# Altium schematic sheet Copy of STM32_microcontroller_IOs.SchDoc: STM32_microcontroller_IOs
size A4; Date: Not used; ApprovedBy: Not used; CheckedBy: Not used; Author: Not used; CompanyName: STMicroelectronics; DrawnBy: Not used; Engineer: Not used; Organization: Not used; Address1: Not used; Address2: Not used; Address3: Not used; Address4: Not used; DocumentNumber: 3; Revision: Not used; SheetNumber: 3; SheetTotal: 9; CurrentTime: Not used; CurrentDate: Not used; Time: Not used; DocumentFullPathAndName: Not used; DocumentName: Not used; ModifiedDate: Not used; ImagePath: Not used; ProjectName: Not used; Application_BuildNumber: Not used
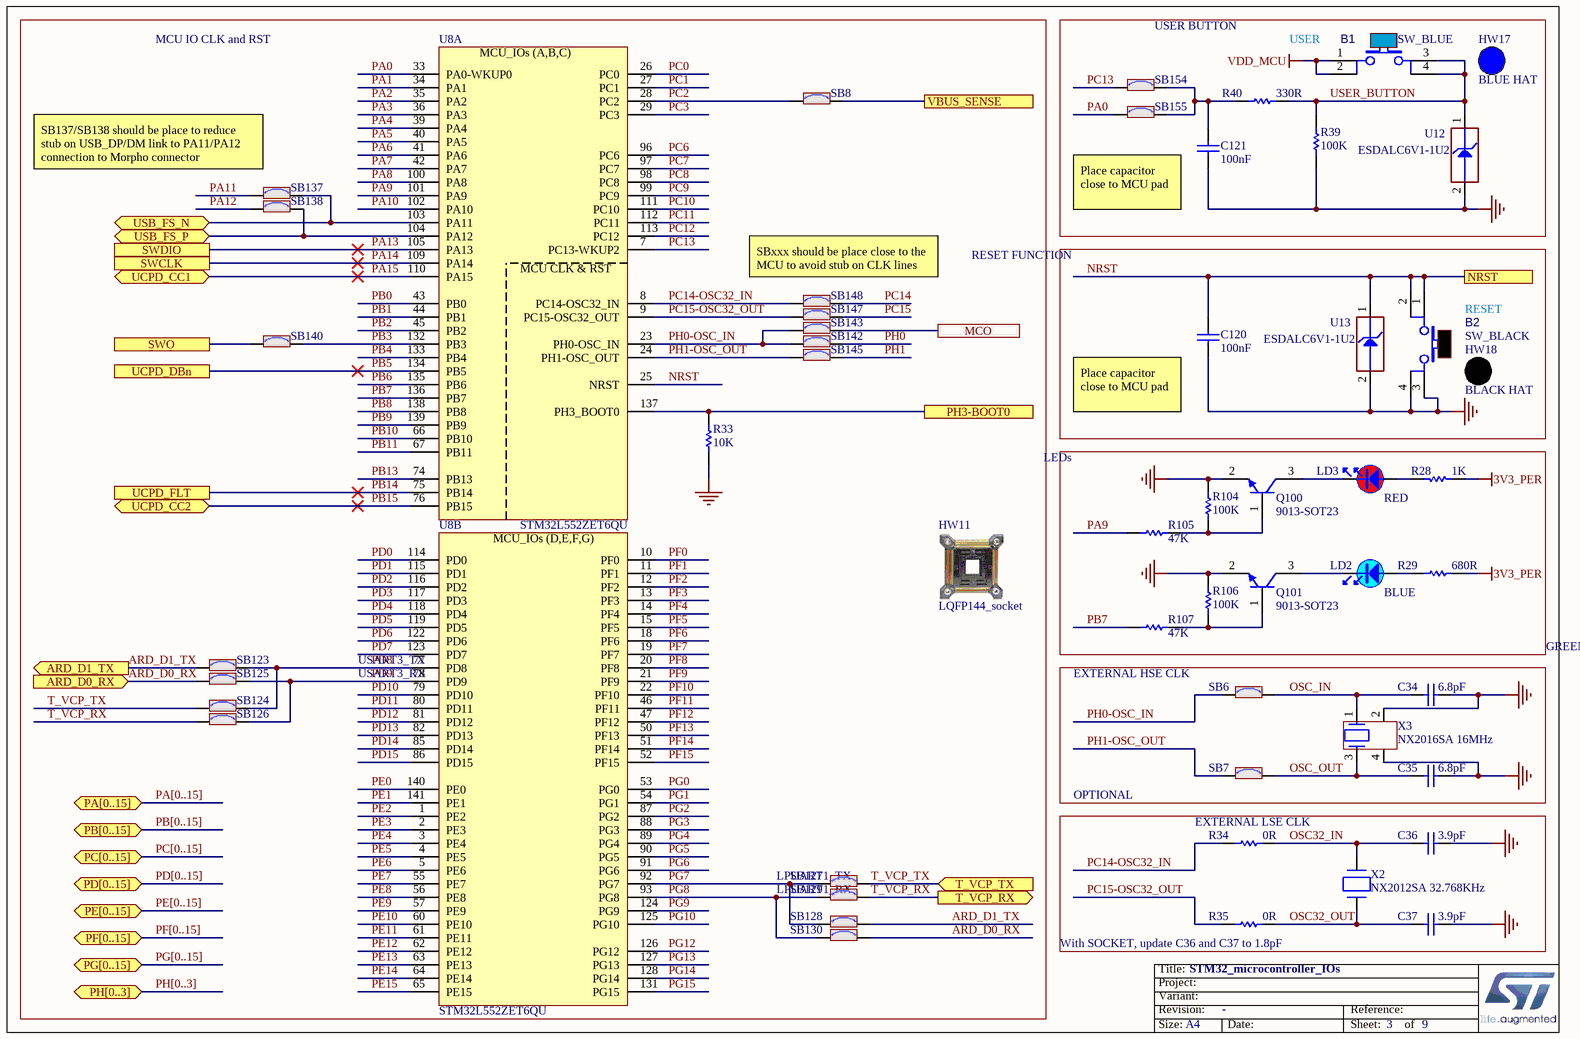
[diagram p0: Copy of STM32_microcontroller_IOs.SchDoc]

## Parts
B1  value SW_BLUE  [SWI_WEALTHMETAL_TD-0341_4P_BLUE]
B2  value SW_BLACK  [SWI_WEALTHMETAL_TD-0341_4P_BLACK]
C34  value 6.8pF  [C0402]  (hidden comment: Capacitor)
C35  value 6.8pF  [C0402]  (hidden comment: Capacitor)
C36  value 3.9pF  [C0402]  (hidden comment: Capacitor)
C37  value 3.9pF  [C0402]  (hidden comment: Capacitor)
C120  value 100nF  [C0603]
C121  value 100nF  [C0603]
HW11  value LQFP144_socket  (mechanical)
HW17  value BLUE HAT  (mechanical)
HW18  value BLACK HAT  (mechanical)
LD2  value BLUE  [LED_0603_VISHAY_VLMB1300-GS08_BLUE_1A2K_H0P8]
LD3  value RED  [LED_0603_RED_H0P4]
Q100  value 9013-SOT23  [NPN_SOT23]
Q101  value 9013-SOT23  [NPN_SOT23]
R28  value 1K  [R0603]
R29  value 680R  [R0603]
R33  value 10K  [R0603]
R34  value 0R  [R0603]
R35  value 0R  [R0603]
R39  value 100K  [R0603]
R40  value 330R  [R0603]
R104  value 100K  [R0603]
R105  value 47K  [R0603]
R106  value 100K  [R0603]
R107  value 47K  [R0603]
SB6  (no value)  [SOLDER-BRIDGE_R0603-0R]
SB7  (no value)  [SOLDER-BRIDGE_R0603-0R]
SB8  (no value)  [SOLDER-BRIDGE_R0603-0R]
SB123  (no value)  [SOLDER-BRIDGE_R0603-0R]
SB124  (no value)  [SOLDER-BRIDGE_R0603-0R]
SB125  (no value)  [SOLDER-BRIDGE_R0603-0R]
SB126  (no value)  [SOLDER-BRIDGE_R0603-0R]
SB127  (no value)  [SOLDER-BRIDGE_R0603-0R]
SB128  (no value)  [SOLDER-BRIDGE_R0603-0R]
SB129  (no value)  [SOLDER-BRIDGE_R0603-0R]
SB130  (no value)  [SOLDER-BRIDGE_R0603-0R]
SB137  (no value)  [SOLDER-BRIDGE_R0603-0R]
SB138  (no value)  [SOLDER-BRIDGE_R0603-0R]
SB140  (no value)  [SOLDER-BRIDGE_R0603-0R]
SB142  (no value)  [SOLDER-BRIDGE_R0603-0R]
SB143  (no value)  [SOLDER-BRIDGE_R0603-0R]
SB145  (no value)  [SOLDER-BRIDGE_R0603-0R]
SB147  (no value)  [SOLDER-BRIDGE_R0603-0R]
SB148  (no value)  [SOLDER-BRIDGE_R0603-0R]
SB154  (no value)  [SOLDER-BRIDGE_R0603-0R]
SB155  (no value)  [SOLDER-BRIDGE_R0603-0R]
U8  STM32L552ZET6QU  [ICC_LQFP144_20X20_P050]  (parts A,B of 3)
U12  value ESDALC6V1-1U2  [ESD_ST0201]
U13  value ESDALC6V1-1U2  [ESD_ST0201]
X2  value NX2012SA 32.768KHz  [CRY_NX2012SA_2P]  (hidden comment: XTAL_2_PINS)
X3  value NX2016SA 16MHz  [CRY_NX2016SA_4P]  (hidden comment: XTAL_4_PINS)

## Blocks framed on the sheet
LEDs: LD2 LD3 Q100 Q101 R28 R29 R104-R107

## Ports
ARD_D0_RX (in), ARD_D1_TX (out), MCO, NRST, PA[0..15] (bidir), PB[0..15] (bidir), PC[0..15] (bidir), PD[0..15] (bidir), PE[0..15] (bidir), PF[0..15] (bidir), PG[0..15] (bidir), PH3-BOOT0, PH[0..3] (bidir), SWCLK, SWDIO, SWO, T_VCP_RX (out), T_VCP_TX (in), UCPD_CC1 (bidir), UCPD_CC2 (bidir), UCPD_DBn, UCPD_FLT, USB_FS_N (bidir), USB_FS_P (bidir), VBUS_SENSE

## Nets
3V3_PER: R28.1 R29.1
GND: B2.3 B2.4 C34.2 C35.2 C36.2 C37.2 C120.1 C121.1 Q100.2(E) Q101.2(E) R33.2 R39.1 R104.1 R106.1 U12.2(GND) U13.2(GND) X3.2 X3.4
VDD_MCU: B1.1 B1.2
ARD_D0_RX: SB125.2 SB130.1 ; port ARD_D0_RX
ARD_D1_TX: SB123.2 SB128.1 ; port ARD_D1_TX
MCO: SB143.2 ; port MCO
NRST: B2.1 B2.2 C120.2 U8.25(NRST) U13.1(IO1) ; port NRST
OSC32_IN: C36.1 R34.2 X2.2(X2)
OSC32_OUT: C37.1 R35.2 X2.1(X1)
OSC_IN: C34.1 SB6.2 X3.1
OSC_OUT: C35.1 SB7.2 X3.3
PA0: SB155.2 U8.33(PA0-WKUP0)
PA1: U8.34(PA1)
PA2: U8.35(PA2)
PA3: U8.36(PA3)
PA4: U8.39(PA4)
PA5: U8.40(PA5)
PA6: U8.41(PA6)
PA7: U8.42(PA7)
PA8: U8.100(PA8)
PA9: R105.1 U8.101(PA9)
PA10: U8.102(PA10)
PA11: SB137.1
PA12: SB138.1
PA13: U8.105(PA13) ; port SWDIO
PA14: U8.109(PA14) ; port SWCLK
PA15: U8.110(PA15) ; port UCPD_CC1
PB0: U8.43(PB0)
PB1: U8.44(PB1)
PB2: U8.45(PB2)
PB3: SB140.2 U8.132(PB3)
PB4: U8.133(PB4)
PB5: U8.134(PB5) ; port UCPD_DBn
PB6: U8.135(PB6)
PB7: R107.1 U8.136(PB7)
PB8: U8.138(PB8)
PB9: U8.139(PB9)
PB10: U8.66(PB10)
PB11: U8.67(PB11)
PB13: U8.74(PB13)
PB14: U8.75(PB14) ; port UCPD_FLT
PB15: U8.76(PB15) ; port UCPD_CC2
PC0: U8.26(PC0)
PC1: U8.27(PC1)
PC2: SB8.1 U8.28(PC2)
PC3: U8.29(PC3)
PC6: U8.96(PC6)
PC7: U8.97(PC7)
PC8: U8.98(PC8)
PC9: U8.99(PC9)
PC10: U8.111(PC10)
PC11: U8.112(PC11)
PC12: U8.113(PC12)
PC13: SB154.2 U8.7(PC13-WKUP2)
PC14: SB148.2
PC14-OSC32_IN: R34.1 SB148.1 U8.8(PC14-OSC32_IN)
PC15: SB147.2
PC15-OSC32_OUT: R35.1 SB147.1 U8.9(PC15-OSC32_OUT)
PD0: U8.114(PD0)
PD1: U8.115(PD1)
PD2: U8.116(PD2)
PD3: U8.117(PD3)
PD4: U8.118(PD4)
PD5: U8.119(PD5)
PD6: U8.122(PD6)
PD7: U8.123(PD7)
PD8: SB123.1 SB124.1 U8.77(PD8)
PD9: SB125.1 SB126.1 U8.78(PD9)
PD10: U8.79(PD10)
PD11: U8.80(PD11)
PD12: U8.81(PD12)
PD13: U8.82(PD13)
PD14: U8.85(PD14)
PD15: U8.86(PD15)
PE0: U8.140(PE0)
PE1: U8.141(PE1)
PE2: U8.1(PE2)
PE3: U8.2(PE3)
PE4: U8.3(PE4)
PE5: U8.4(PE5)
PE6: U8.5(PE6)
PE7: U8.55(PE7)
PE8: U8.56(PE8)
PE9: U8.57(PE9)
PE10: U8.60(PE10)
PE11: U8.61(PE11)
PE12: U8.62(PE12)
PE13: U8.63(PE13)
PE14: U8.64(PE14)
PE15: U8.65(PE15)
PF0: U8.10(PF0)
PF1: U8.11(PF1)
PF2: U8.12(PF2)
PF3: U8.13(PF3)
PF4: U8.14(PF4)
PF5: U8.15(PF5)
PF6: U8.18(PF6)
PF7: U8.19(PF7)
PF8: U8.20(PF8)
PF9: U8.21(PF9)
PF10: U8.22(PF10)
PF11: U8.46(PF11)
PF12: U8.47(PF12)
PF13: U8.50(PF13)
PF14: U8.51(PF14)
PF15: U8.52(PF15)
PG0: U8.53(PG0)
PG1: U8.54(PG1)
PG2: U8.87(PG2)
PG3: U8.88(PG3)
PG4: U8.89(PG4)
PG5: U8.90(PG5)
PG6: U8.91(PG6)
PG7: SB127.2 SB128.2 U8.92(PG7)
PG8: SB129.2 SB130.2 U8.93(PG8)
PG9: U8.124(PG9)
PG10: U8.125(PG10)
PG12: U8.126(PG12)
PG13: U8.127(PG13)
PG14: U8.128(PG14)
PG15: U8.131(PG15)
PH0: SB142.2
PH0-OSC_IN: SB6.1 SB142.1 SB143.1 U8.23(PH0-OSC_IN)
PH1: SB145.2
PH1-OSC_OUT: SB7.1 SB145.1 U8.24(PH1-OSC_OUT)
PH3-BOOT0: R33.1 U8.137(PH3_BOOT0) ; port PH3-BOOT0
SWO: SB140.1 ; port SWO
T_VCP_RX: SB126.2 SB129.1 ; port T_VCP_RX
T_VCP_TX: SB124.2 SB127.1 ; port T_VCP_TX
USB_FS_N: SB137.2 U8.103(PA11) ; port USB_FS_N
USB_FS_P: SB138.2 U8.104(PA12) ; port USB_FS_P
USER_BUTTON: B1.3 B1.4 R39.2 R40.2 U12.1(IO1)
VBUS_SENSE: SB8.2 ; port VBUS_SENSE
NetC121_2: C121.2 R40.1 SB154.1 SB155.1
NetLD2_1: LD2.1 R29.2
NetLD2_2: LD2.2 Q101.3(C)
NetLD3_1: LD3.1 R28.2
NetLD3_2: LD3.2 Q100.3(C)
NetQ100_1: Q100.1(B) R104.2 R105.2
NetQ101_1: Q101.1(B) R106.2 R107.2

## Buses and harness runs
bus PA[0..15] = port PA[0..15]
bus PB[0..15] = port PB[0..15]
bus PC[0..15] = port PC[0..15]
bus PD[0..15] = port PD[0..15]
bus PE[0..15] = port PE[0..15]
bus PF[0..15] = port PF[0..15]
bus PG[0..15] = port PG[0..15]
bus PH[0..3] = port PH[0..3]

## Notes on the sheet
- MCU IO CLK and RST
- USER BUTTON
- USER
- SB137/SB138 should be place to reduce stub on USB_DP/DM link to PA11/PA12 connection to Morpho connector
- Place capacitor close to MCU pad
- SBxxx should be place close to the MCU to avoid stub on CLK lines
- RESET FUNCTION
- RESET
- (near C120) Place capacitor close to MCU pad
- (near C34) GREEN LED IS ON ARDUINO SHEET
- USART3_TX
- USART3_RX
- (near R107) EXTERNAL HSE CLK
- OPTIONAL
- EXTERNAL LSE CLK
- LPUART1_TX
- LPUART1_RX
- (near R35) With SOCKET, update C36 and C37 to 1.8pF
- Title:
- Project:
- Size:
- Revision:
- Variant:
- A4
- -
- Date:
- Reference:
- Sheet:
- of
- (in symbol MCD-01055, part A) MCU_IOs (A,B,C); MCU CLK & RST
- (in symbol MCD-01055, part B) MCU_IOs (D,E,F,G)

## Library data of the parts
B1 = MCD-00002: Non-Open Push-Button 0.1A 24V BLUE; Manufacturer_Part_Number: TD0341X-G01-BLU; Manufacturer: WEALTHMETAL; Part_Type: Misc; Provided_By: Subcon; Initial_Board_Reference: MB1274; Internal_Part_Number: MCD-00002; ECCN_US: n/a; ECCN_EU: n/a; ComponentLink1Description: Datasheet; Status: Released; ComponentLink1URL: http://tunmcdsvn.tun.st.com/Component_Datasheet_Library/Trunk/Misc/Wealthmetal_Tact-Switch_TD0341; Order_Code_Farnell: 535-930
B2 = MCD-00001: Non-Open Push-Button 0.1A 24V BLACK; Manufacturer_Part_Number: TD0341X-G01-BLA; Manufacturer: WEALTHMETAL; Part_Type: Misc; Provided_By: Subcon; Initial_Board_Reference: MB1274; Internal_Part_Number: MCD-00001; ECCN_US: n/a; ECCN_EU: n/a; ComponentLink1Description: Datasheet; Status: Released; ComponentLink1URL: http://tunmcdsvn.tun.st.com/Component_Datasheet_Library/Trunk/Misc/Wealthmetal_Tact-Switch_TD0341; Order_Code_Farnell: 535-930
C34 C35 = MCD-00674: Capacitor, MLCC, 6.8pF, 50V, NPO, +-0.25pF, 0402, T=0.5mm; Manufacturer_Part_Number: CC0402CRNPO9BN6R8; Manufacturer: YAGEO; Provided_By: Subcon; Initial_Board_Reference: MB1319; Internal_Part_Number: MCD-00674; Status: Released; Part_Type: Capacitor; Package: C0402; ComponentLink1Description: Datasheet; ComponentLink1URL: http://tunmcdsvn.tun.st.com/Component_Datasheet_Library/Trunk/Capacitors/Yageo_Capacitor_NP0_16V-to-50V
C36 C37 = MCD-00556: Capacitor, MLCC, 3.9pF, 50V, NPO, +-0.25pF, 0402, T=0,5mm; Manufacturer_Part_Number: CC0402CRNPO9BN3R9; Manufacturer: YAGEO; ECCN_US: EAR99; ECCN_EU: NEC; Provided_By: SUBCO; Internal_Part_Number: MCD-00556; Status: Released; Part_Type: Capacitor; Package: C0402; ComponentLink1Description: Datasheet; ComponentLink1URL: http://tunmcdsvn.tun.st.com/Component_Datasheet_Library/Trunk/Capacitors/Yageo_Capacitor_NP0_16V-to-50V
C120 C121 = MCD-00211: Capacitor, MLCC, 100nF, 16V, X7R, 10%, 0603, T=0,8mm; Manufacturer_Part_Number: CC0603KRX7R7BB104; Manufacturer: YAGEO; Provided_By: Subcon; Initial_Board_Reference: MB1319; Internal_Part_Number: MCD-00211; ECCN_US: n/a; ECCN_EU: n/a; ComponentLink1Description: Datasheet; Status: Released; Part_Type: Capacitor; Package: C0603; ComponentLink1URL: http://tunmcdsvn.tun.st.com/Component_Datasheet_Library/Trunk/Capacitors/Yageo_Multilayer_Capacitor_X7R_series_100pF_to_22uF
HW11 = MCD-01015: Yamaichi socket for LQFP144, with positioning pins.; Part_Type: Misc; Manufacturer_Part_Number: IC149-144-145-B5; Provided_By: Subcon; Initial_Board_Reference: MB1361; Remark: No footprint, mechanical part for BOM; Internal_Part_Number: MCD-01015; Status: Checked; Manufacturer: YAMAICHI; ComponentLink1Description: Datasheet; ComponentLink1URL: http://tunmcdsvn.tun.st.com/Component_Datasheet_Library/Trunk/Misc/Yamaichi_LQFP_socket_IC149_144_145_B5; ECCN_US: n/a; ECCN_EU: n/a
HW17 = MCD-00634: Blue Hat for switch TD0341X-G01-BLU; Part_Type: Mechanical; Manufacturer_Part_Number: 988.16.09.3.00002_SH-517; Manufacturer: JIUBABA; Provided_By: Subcon; Initial_Board_Reference: MB1319; Internal_Part_Number: MCD-00634; Status: Released; ECCN_US: n/a; ECCN_EU: n/a; ComponentLink1Description: Datasheet; ComponentLink1URL: http://tunmcdsvn.tun.st.com/Component_Datasheet_Library/Trunk/Mechanical/Jiubaba_HAT_SH-517
HW18 = MCD-00635: Black Hat for switch TD0341X-G01-BLA; Part_Type: Mechanical; Manufacturer_Part_Number: 988.16.09.3.00003_SH-517; Manufacturer: JIUBABA; Provided_By: Subcon; Initial_Board_Reference: MB1319; Internal_Part_Number: MCD-00635; Status: Released; ECCN_US: n/a; ECCN_EU: n/a; ComponentLink1Description: Datasheet; ComponentLink1URL: http://tunmcdsvn.tun.st.com/Component_Datasheet_Library/Trunk/Mechanical/Jiubaba_HAT_SH-517
LD2 = MCD-00584: LED Blue, 0603 SMD, 3.3 V Forward Voltage; Part_Type: Display; Manufacturer_Part_Number: VLMB1300-GS08; Manufacturer: VISHAY; Order_Code_RS: 7730430; Provided_By: Subcon; Initial_Board_Reference: MB1331; Internal_Part_Number: MCD-00584; Status: Checked; ComponentLink1Description: Datasheet; ComponentLink1URL: http://tunmcdsvn.tun.st.com/Component_Datasheet_Library/Trunk/Display/VISHAY_LED_BLUE_VLMB1300-GS08; Order_Code_Digikey: VLMB1300-GS08CT-ND; Order_Code_Farnell: 2251459; Package: LED 0603; ECCN_US: n/a; ECCN_EU: n/a
LD3 = MCD-00322: LED, Red, 0603; Part_Type: Display; Manufacturer_Part_Number: 19-217/R6C-AL1M2VY/3T; Manufacturer: EVERLIGHT; ECCN_US: EAR99; ECCN_EU: NEC; Provided_By: Subcon; Initial_Board_Reference: MB1311; Internal_Part_Number: MCD-00322; Status: Released; Package: LED 0603; ComponentLink1Description: Datasheet; ComponentLink1URL: http://tunmcdsvn.tun.st.com/Component_Datasheet_Library/Trunk/Display/Everlight_SMD-LED-RED_19-213-R6C-AP1Q2B-3T-V3.doc
Q100 Q101 = MCD-00073: NPN Bipolar Transistor; Part_Type: IC; Manufacturer_Part_Number: BSR14; Manufacturer: NXP; ECCN_US: EAR99; ECCN_EU: NEC; Provided_By: Subcon; Initial_Board_Reference: MB1274; Revision: *; Internal_Part_Number: MCD-00073; Status: Released; ComponentLink1Description: Datasheet; ComponentLink1URL: http://tunmcdsvn.tun.st.com/Component_Datasheet_Library/Trunk/IC/NXP_Transistor_BSR14
R28 = MCD-00070: Resistor,1K,0603,1%,1/10W; Manufacturer_Part_Number: RC0603FR-071KL; Manufacturer: YAGEO; Provided_By: Subcon; Initial_Board_Reference: MB1274; Internal_Part_Number: MCD-00070; Status: Released; Part_Type: Resistor; ComponentLink1Description: Datasheet; ECCN_US: n/a; ECCN_EU: n/a; Package: R0603; ComponentLink1URL: http://tunmcdsvn.tun.st.com/Component_Datasheet_Library/Trunk/Resistors/Yageo_Resistor_RC0603-series
R29 = MCD-00508: Resistor,680R,0603,1%,1/10W; Manufacturer_Part_Number: RC0603FR-07680RL; Manufacturer: YAGEO; Provided_By: Subcon; Internal_Part_Number: MCD-00508; Status: Released; Part_Type: Resistor; ComponentLink1Description: Datasheet; ECCN_US: n/a; ECCN_EU: n/a; Package: R0603; ComponentLink1URL: http://tunmcdsvn.tun.st.com/Component_Datasheet_Library/Trunk/Resistors/Yageo_Resistor_RC0603-series
R33 = MCD-00220: Resistor,10K,0603,1%,1/10W; Manufacturer_Part_Number: RC0603FR-0710KL; Manufacturer: YAGEO; Provided_By: Subcon; Initial_Board_Reference: MB1319; Internal_Part_Number: MCD-00220; Status: Released; Part_Type: Resistor; ComponentLink1Description: Datasheet; ECCN_US: n/a; ECCN_EU: n/a; Package: R0603; ComponentLink1URL: http://tunmcdsvn.tun.st.com/Component_Datasheet_Library/Trunk/Resistors/Yageo_Resistor_RC0603-series
R34 R35 = MCD-00056: Resistor,0R,0603,5%,1/10W; Manufacturer_Part_Number: RC0603JR-070RL; Manufacturer: YAGEO; Provided_By: subcon; Initial_Board_Reference: MB1274; Internal_Part_Number: MCD-00056; ECCN_US: n/a; ECCN_EU: n/a; ComponentLink1Description: Datasheet; Status: Released; Part_Type: Resistor; Package: R0603; ComponentLink1URL: http://tunmcdsvn.tun.st.com/Component_Datasheet_Library/Trunk/Resistors/Yageo_Resistor_RC0603-series
R39 R104 R106 = MCD-00223: Resistor,100K,0603,1%,1/10W; Manufacturer_Part_Number: RC0603FR-07100KL; Manufacturer: YAGEO; Provided_By: Subcon; Initial_Board_Reference: MB1319; Internal_Part_Number: MCD-00223; ECCN_US: n/a; ECCN_EU: n/a; ComponentLink1Description: Datasheet; Status: Released; Part_Type: Resistor; Package: R0603; ComponentLink1URL: http://tunmcdsvn.tun.st.com/Component_Datasheet_Library/Trunk/Resistors/Yageo_Resistor_RC0603-series
R40 = MCD-00197: Resistor,330R,0603,1%,1/10W; Manufacturer_Part_Number: RC0603FR-07330RL; Manufacturer: YAGEO; Provided_By: Subcon; Internal_Part_Number: MCD-00197; Status: Released; Part_Type: Resistor; Package: R0603; ComponentLink1Description: Datasheet; ComponentLink1URL: http://tunmcdsvn.tun.st.com/Component_Datasheet_Library/Trunk/Resistors/Yageo_Resistor_RC0603-series; ECCN_US: n/a; ECCN_EU: n/a
R105 R107 = MCD-00222: Resistor,47K,0603,1%,1/10W; Manufacturer_Part_Number: RC0603FR-0747KL; Manufacturer: YAGEO; Provided_By: Subcon; Initial_Board_Reference: MB1319; Internal_Part_Number: MCD-00222; Status: Released; Part_Type: Resistor; ComponentLink1Description: Datasheet; ECCN_US: n/a; ECCN_EU: n/a; Package: R0603; ComponentLink1URL: http://tunmcdsvn.tun.st.com/Component_Datasheet_Library/Trunk/Resistors/Yageo_Resistor_RC0603-series
SB6-SB8 SB123-SB130 SB137 SB138 SB140 SB142 SB143 SB145 SB147 SB148 SB154 SB155 = MCD-00071: Solder Bridge ON; Part_Type: Mechanical; Provided_By: Subcon; Initial_Board_Reference: MB1274; Internal_Part_Number: MCD-00071; ECCN_US: n/a; ECCN_EU: n/a; Status: Released; ComponentLink1Description: Datasheet
U8 = MCD-01055: STM32L552ZET6Q MCU,LQFP144 20x20, 0.5, no AES, Q for Int SMPS; Part_Type: IC; Manufacturer: STMICROELECTRONICS; BMS_Part_Number: 9175310; ECCN_US: 3A991A2; ECCN_EU: NEC; Provided_By: SUBCO with ST control; Internal_Part_Number: MCD-01055; Value: STM32L552ZET6QU; Status: Released; Manufacturer_Part_Number: STM32L552ZET6QU; Package: LQFP144; ComponentLink1Description: Datasheet; ComponentLink1URL: http://tunmcdsvn.tun.st.com/Component_Datasheet_Library/Trunk/IC/STM_STM32L552ZET6QU
U12 U13 = MCD-00170: ESD protection 6V1; Part_Type: Diode; Manufacturer: STMICROELECTRONICS; ECCN_US: EAR99; ECCN_EU: NEC; Provided_By: Subcon; Initial_Board_Reference: MB1274; Internal_Part_Number: MCD-00170; Status: Released; Manufacturer_Part_Number: ESDALC6V1-1U2; ComponentLink1Description: Datasheet; ComponentLink1URL: http://tunmcdsvn.tun.st.com/Component_Datasheet_Library/Trunk/Diodes/STM_ESD_ESDALC6V1-1U2
X2 = MCD-01479: Crystal 32.768kHz, 6pF, -+20PPM, R=80K, SMD; Part_Type: Crystal_Osc; Manufacturer_Part_Number: NX2012SA 32.768KHz EXS00A-MU00527; Manufacturer: NDK; Provided_By: SUBCO; Initial_Board_Reference: MB1373; Item Type: Item; Path: ws/MCD_ApplicationBoards/Lists/MCDPARTSdatabase; Internal_Part_Number: MCD-01479; Status: Checked; Package: NX2012SA; ComponentLink1Description: Datasheet; ComponentLink1URL: http://tunmcdsvn.tun.st.com/Component_Datasheet_Library/Trunk/Crystal_Osc/NDK_NX2012SA 32.768KHz EXS00A-MU00527
X3 = MCD-01476: Crystal 16 MHz, 8pF, -+20 PPM, R=200Ω, SMD; Part_Type: Crystal_Osc; Manufacturer_Part_Number: NX2016SA 16 MHz EXS00A-CS07826; Manufacturer: NDK; Provided_By: ST; Initial_Board_Reference: MB1373; Item Type: Item; Path: ws/MCD_ApplicationBoards/Lists/MCDPARTSdatabase; Internal_Part_Number: MCD-01476; Status: Symbol available; Package: NX2016SA; ComponentLink1Description: Datasheet; ComponentLink1URL: http://tunmcdsvn.tun.st.com/Component_Datasheet_Library/Trunk/Crystal_Osc/NDK_NX2016SA 16MHz EXS00A-CS07826 (EXS10B-21237)